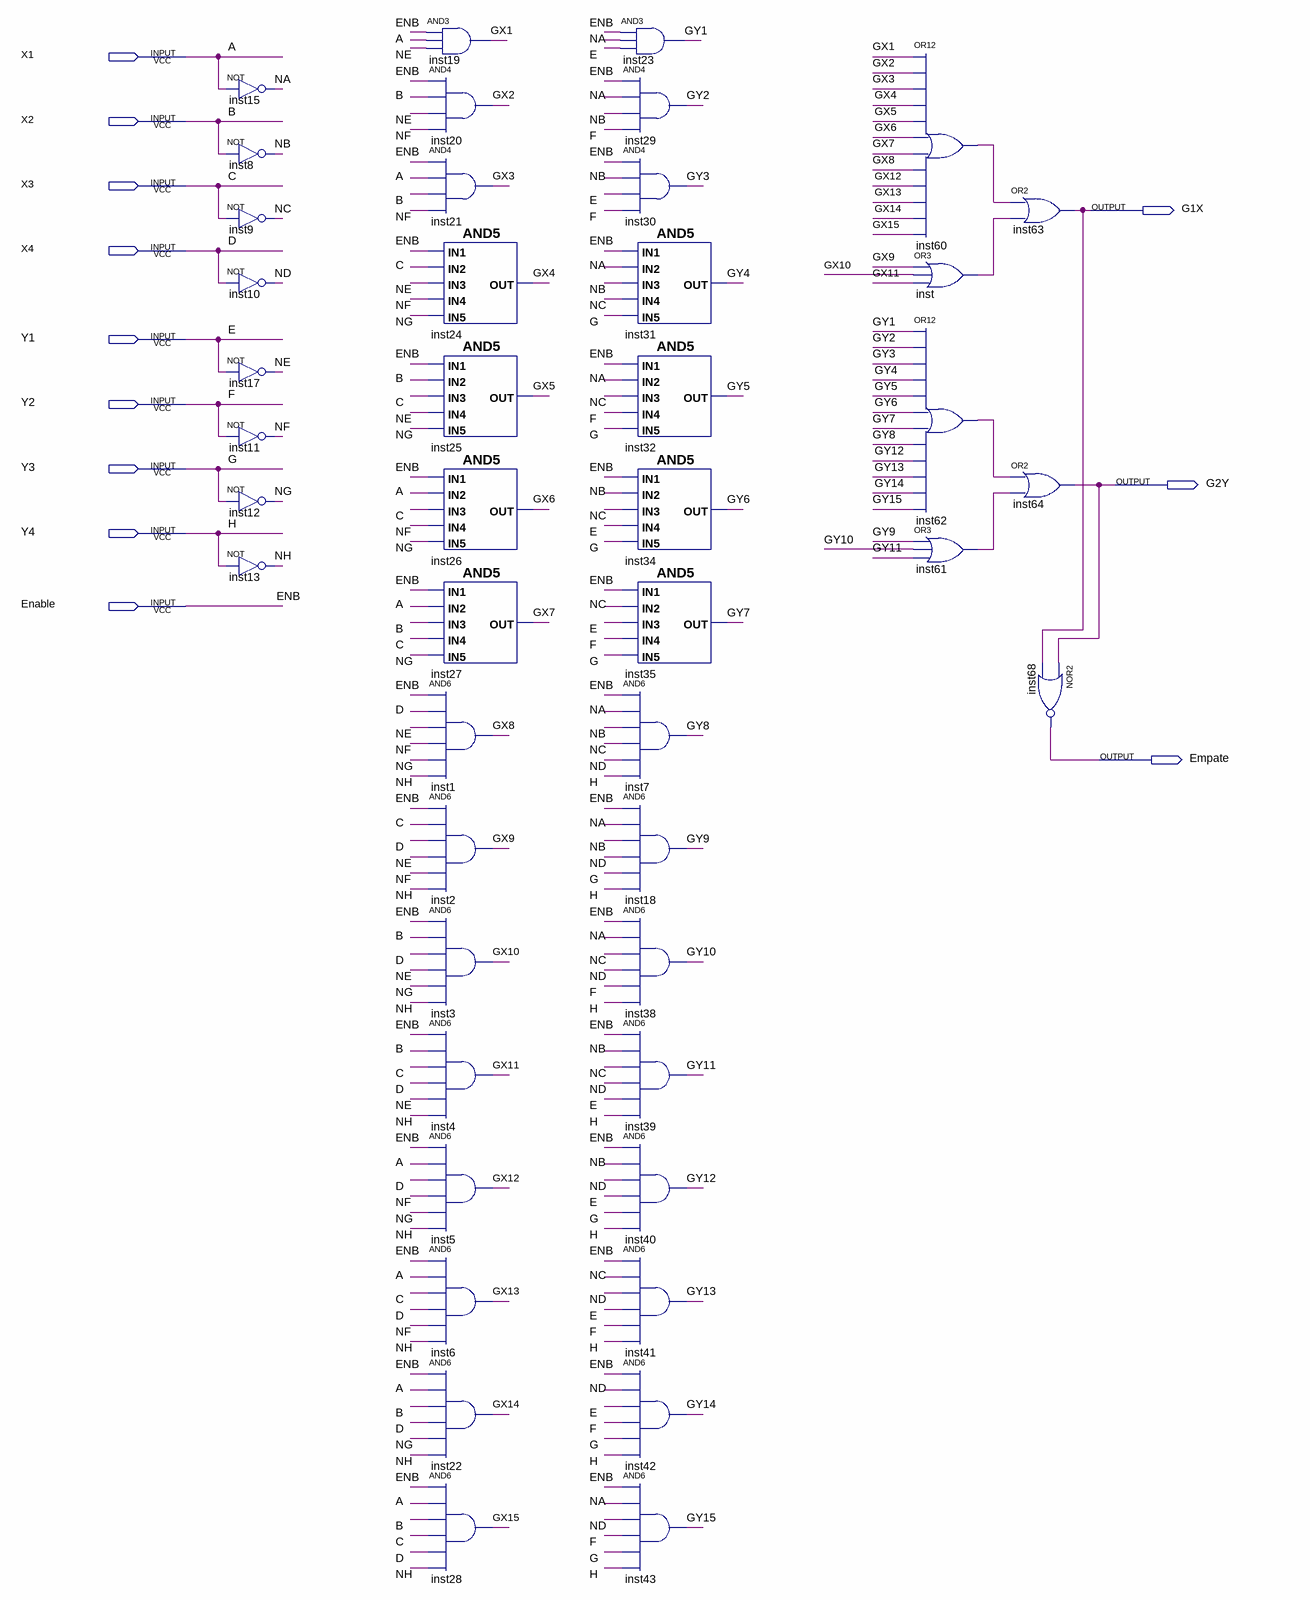
[diagram p0: schematic sheet]
// Quartus schematic Comparador.bdf as structural Verilog: 45 symbols, 12 pins
module Comparador (
  input  X1,
  input  X2,
  input  X3,
  input  X4,
  input  Y1,
  input  Y2,
  input  Y3,
  input  Y4,
  input  Enable,
  output G1X,
  output G2Y,
  output Empate
);

  wire GX1, GX2, GX3, GX4, GX5, GX6, GX7, GX8, GX9, GX10, GX11, GX12, GX13, GX14, GX15, GY1, GY2, GY3, GY4,
       GY5, GY6, GY7, GY8, GY9, GY10, GY11, GY12, GY13, GY14, GY15, inst60_out, inst61_out, inst62_out,
       inst_out, NA, NB, NC, ND, NE, NF, NG, NH;

  not inst15 (NA, X1);
  not inst8 (NB, X2);
  not inst9 (NC, X3);
  not inst10 (ND, X4);
  not inst17 (NE, Y1);
  not inst11 (NF, Y2);
  not inst12 (NG, Y3);
  not inst13 (NH, Y4);
  and inst19 (GX1, Enable, X1, NE);
  and inst20 (GX2, Enable, X2, NE, NF);
  and inst21 (GX3, Enable, X1, X2, NF);
  and inst24 (GX4, Enable, X3, NE, NF, NG);
  and inst25 (GX5, Enable, X2, X3, NE, NG);
  and inst26 (GX6, Enable, X1, X3, NF, NG);
  and inst27 (GX7, Enable, X1, X2, X3, NG);
  and inst1 (GX8, Enable, X4, NE, NF, NG, NH);
  and inst2 (GX9, Enable, X3, X4, NE, NF, NH);
  and inst3 (GX10, Enable, X2, X4, NE, NG, NH);
  and inst4 (GX11, Enable, X2, X3, X4, NE, NH);
  and inst5 (GX12, Enable, X1, X4, NF, NG, NH);
  and inst6 (GX13, Enable, X1, X3, X4, NF, NH);
  and inst22 (GX14, Enable, X1, X2, X4, NG, NH);
  and inst28 (GX15, Enable, X1, X2, X3, X4, NH);
  and inst23 (GY1, Enable, NA, Y1);
  and inst29 (GY2, Enable, NA, NB, Y2);
  and inst30 (GY3, Enable, NB, Y1, Y2);
  and inst31 (GY4, Enable, NA, NB, NC, Y3);
  and inst32 (GY5, Enable, NA, NC, Y2, Y3);
  and inst34 (GY6, Enable, NB, NC, Y1, Y3);
  and inst35 (GY7, Enable, NC, Y1, Y2, Y3);
  and inst7 (GY8, Enable, NA, NB, NC, ND, Y4);
  and inst18 (GY9, Enable, NA, NB, ND, Y3, Y4);
  and inst38 (GY10, Enable, NA, NC, ND, Y2, Y4);
  and inst39 (GY11, Enable, NB, NC, ND, Y1, Y4);
  and inst40 (GY12, Enable, NB, ND, Y1, Y3, Y4);
  and inst41 (GY13, Enable, NC, ND, Y1, Y2, Y4);
  and inst42 (GY14, Enable, ND, Y1, Y2, Y3, Y4);
  and inst43 (GY15, Enable, NA, ND, Y2, Y3, Y4);
  or inst60 (inst60_out, GX1, GX2, GX3, GX4, GX5, GX6, GX7, GX8, GX12, GX13, GX14, GX15);
  or inst (inst_out, GX9, GX10, GX11);
  or inst62 (inst62_out, GY1, GY2, GY3, GY4, GY5, GY6, GY7, GY8, GY12, GY13, GY14, GY15);
  or inst61 (inst61_out, GY9, GY10, GY11);
  or inst63 (G1X, inst60_out, inst_out);
  or inst64 (G2Y, inst62_out, inst61_out);
  nor inst68 (Empate, G2Y, G1X);

  // Other names for the same wires on the sheet: ENB = Enable; A = X1; B = X2; C = X3; D = X4; E = Y1; F = Y2; G = Y3;
  //   H = Y4
endmodule
